# EAGLE design i2s-shifter_rev1 (EAGLE 6.4)
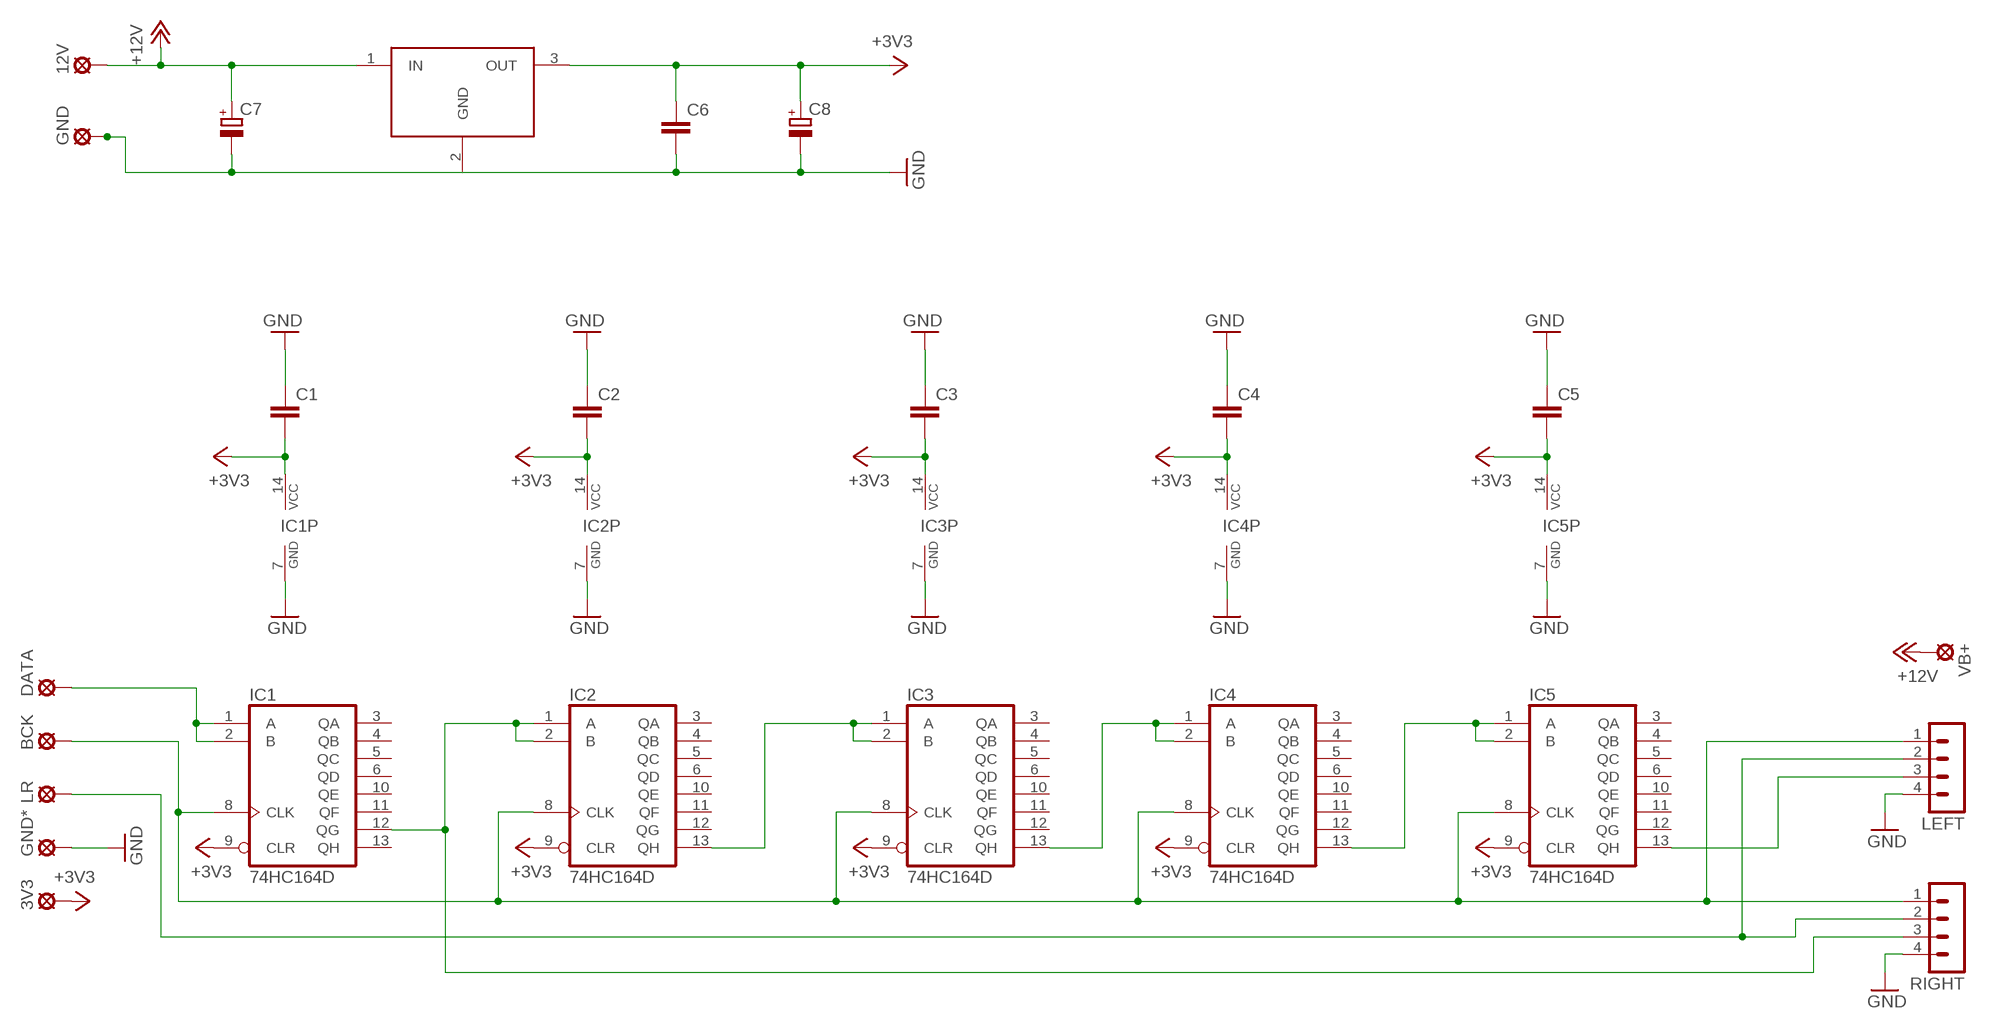
[diagram p0: schematic, sheet 1]

## Parts
3V3  LSP10  [LSP10]
12V  LSP10  [LSP10]
BCK  LSP10  [LSP10]
C1  C-EU050-025X075  [C050-025X075]
C2  C-EU050-025X075  [C050-025X075]
C3  C-EU050-025X075  [C050-025X075]
C4  C-EU050-025X075  [C050-025X075]
C5  C-EU050-025X075  [C050-025X075]
C6  C-EU050-025X075  [C050-025X075]
C7  CPOL-EUE7.5-16  [E7,5-16]
C8  CPOL-EUE5-10.5  [E5-10,5]
DATA  LSP10  [LSP10]
GND  LSP10  [LSP10]
GND*  LSP10  [LSP10]
IC1  74HC164D  [SO14]
IC2  74HC164D  [SO14]
IC3  74HC164D  [SO14]
IC4  74HC164D  [SO14]
IC5  74HC164D  [SO14]
IT1  LM3940IT-3.3  [TO220V]
LEFT  MA04-1  [MA04-1]
LR  LSP10  [LSP10]
RIGHT  MA04-1  [MA04-1]
VB+  LSP10  [LSP10]

## Nets
+3V3: 3V3.MP C1.2 C2.2 C3.2 C4.2 C5.2 C6.1 C8.+ IC1.9(CLR) IC1.14(VCC) IC2.9(CLR) IC2.14(VCC) IC3.9(CLR) IC3.14(VCC) IC4.9(CLR) IC4.14(VCC) IC5.9(CLR) IC5.14(VCC) IT1.3(OUT)
+12V: 12V.MP C7.+ IT1.1(IN) VB+.MP
GND: C1.1 C2.1 C3.1 C4.1 C5.1 C6.2 C7.- C8.- GND*.MP GND.MP IC1.7(GND) IC2.7(GND) IC3.7(GND) IC4.7(GND) IC5.7(GND) LEFT.4 RIGHT.4
N$1: DATA.MP IC1.1(A) IC1.2(B)
N$2: BCK.MP IC1.8(CLK) IC2.8(CLK) IC3.8(CLK) IC4.8(CLK) IC5.8(CLK) LEFT.1 RIGHT.1
N$3: IC1.12(QG) IC2.1(A) IC2.2(B) RIGHT.3
N$4: IC2.13(QH) IC3.1(A) IC3.2(B)
N$5: IC3.13(QH) IC4.1(A) IC4.2(B)
N$6: IC4.13(QH) IC5.1(A) IC5.2(B)
N$7: LEFT.2 LR.MP RIGHT.2
N$8: IC5.13(QH) LEFT.3
Unconnected: IC1.3(QA) IC1.4(QB) IC1.5(QC) IC1.6(QD) IC1.10(QE) IC1.11(QF) IC1.13(QH) IC2.3(QA) IC2.4(QB) IC2.5(QC) IC2.6(QD) IC2.10(QE) IC2.11(QF) IC2.12(QG) IC3.3(QA) IC3.4(QB) IC3.5(QC) IC3.6(QD) IC3.10(QE) IC3.11(QF) IC3.12(QG) IC4.3(QA) IC4.4(QB) IC4.5(QC) IC4.6(QD) IC4.10(QE) IC4.11(QF) IC4.12(QG) IC5.3(QA) IC5.4(QB) IC5.5(QC) IC5.6(QD) IC5.10(QE) IC5.11(QF) IC5.12(QG)

## Power pins joined to a net without a drawn wire
GND: IT1.2(GND)

## Library data of the parts
3V3 12V BCK DATA GND GND* LR VB+ = solpad:LSP10: SOLDER PAD drill 1.0 mm, distributor Buerklin, 12H555
C1-C6 = resistor:C-EU: CAPACITOR, European symbol
C7 C8 = resistor:CPOL-EU: POLARIZED CAPACITOR, European symbol
IC1-IC5 = 74xx-eu:74*164: 8-bit parallel out SHIFT REGISTER
IT1 = LM3940:LM3940IT-3.3: 1A Low Dropout Regulator for 5V to 3.3V Conversion
LEFT RIGHT = con-lstb:MA04-1: PIN HEADER; OC_FARNELL: unknown; OC_NEWARK: unknown

## Board
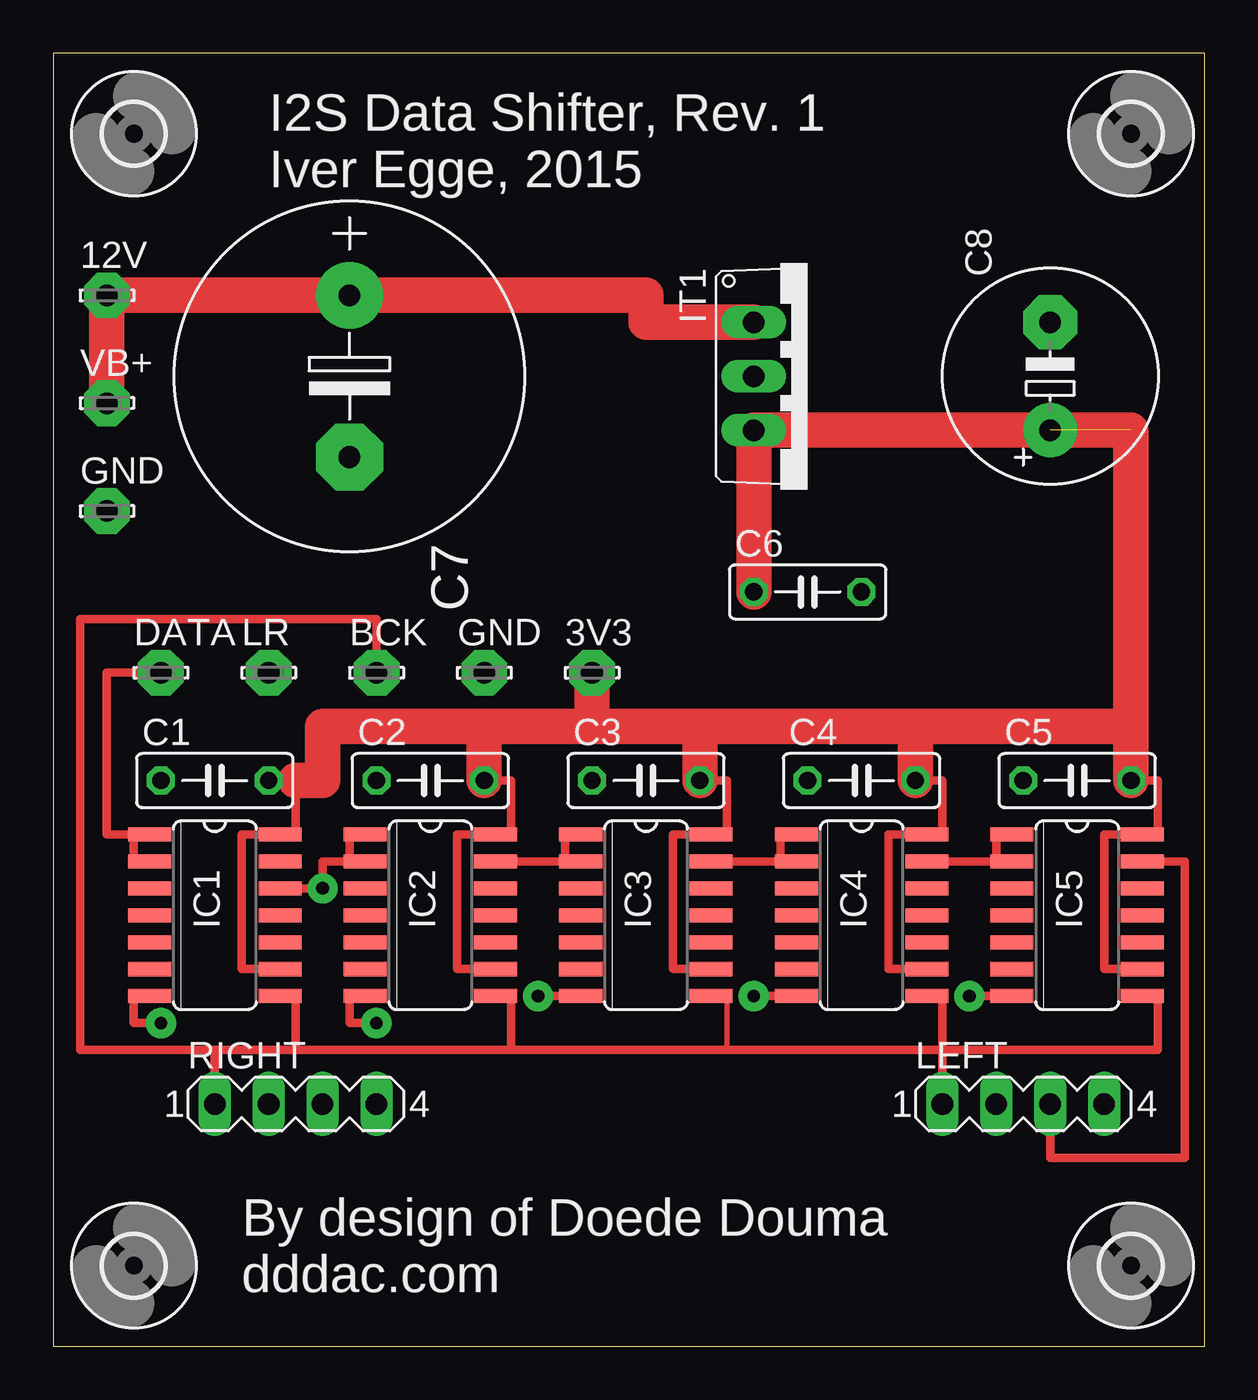
[diagram p1: board, top side]
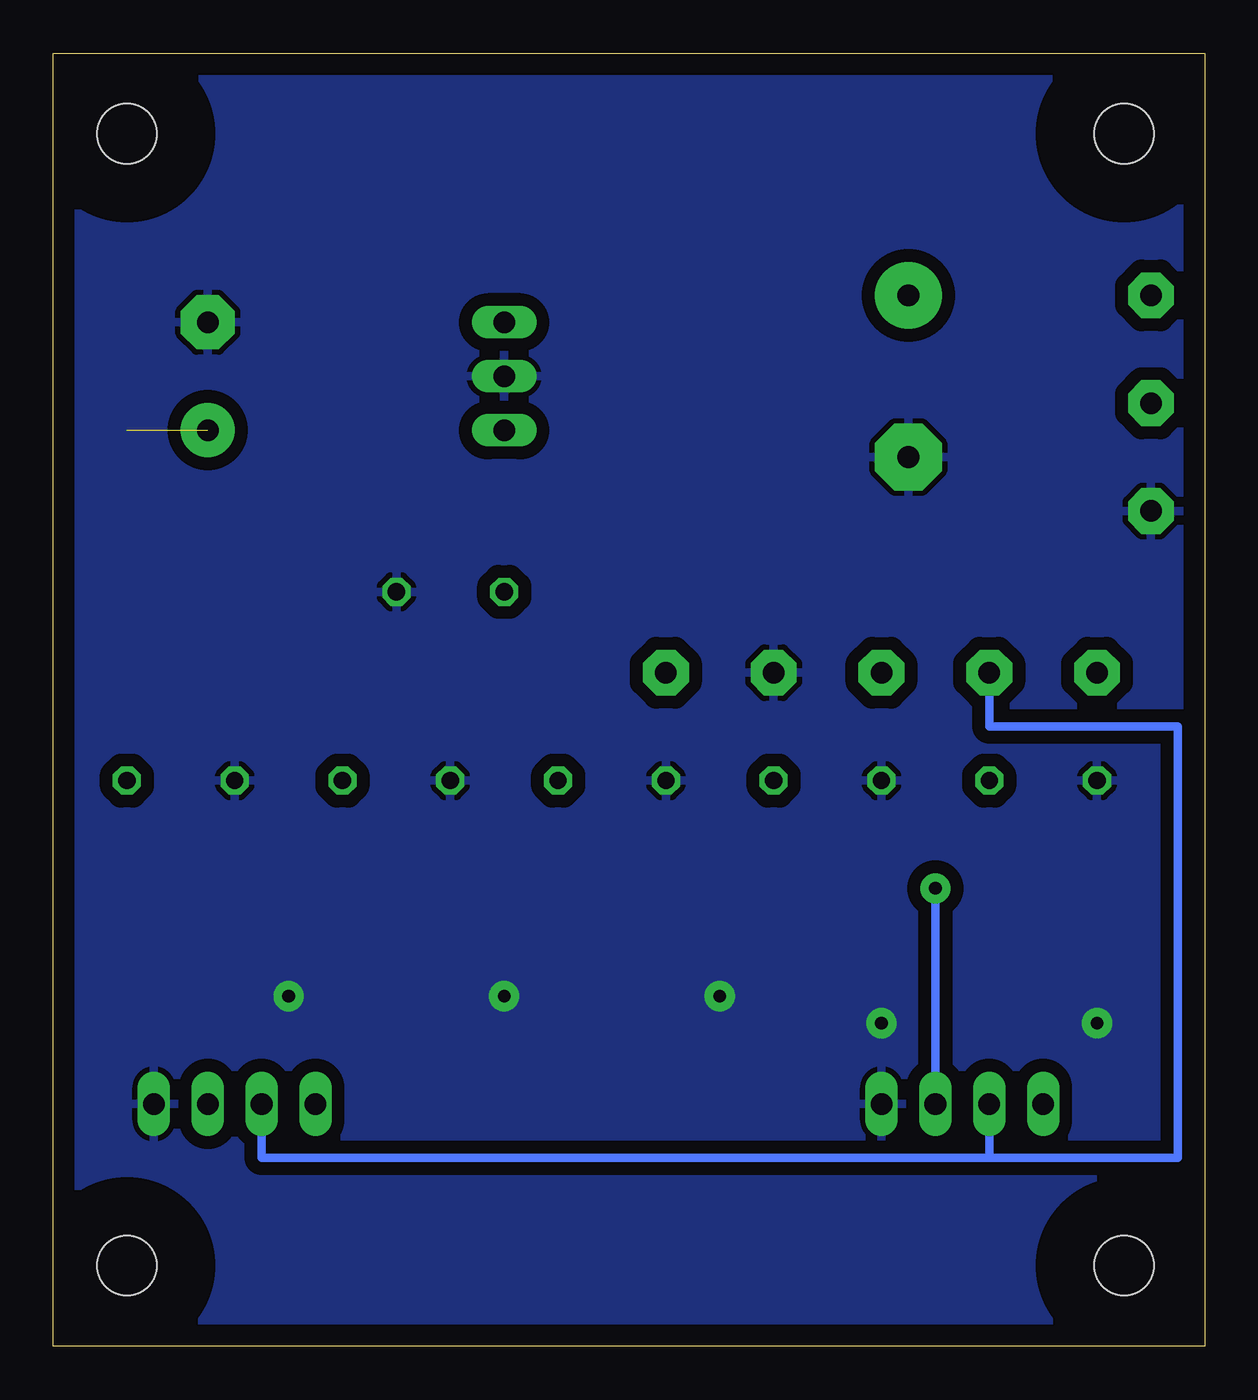
[diagram p2: board, bottom side, seen from below]

Size 54.28 x 60.95 mm. Coordinates in mm from the lower left corner, seen from the top.
Outline: 0,0 54.28,0 54.28,60.95 0,60.95 0,0
Copper layers (1*16): Top 0.035mm / dielectric 1.5mm / Bottom 0.035mm
Design rules "default": minimum track width 10mil, minimum drill 24mil, track to track 8mil, track to pad 8mil, pad to pad 8mil, via to via 8mil, smd to smd 8mil, copper to edge 40mil, drill to drill 8mil, minimum pad ring 10mil, minimum via ring 8mil, stop-mask expansion 4mil, vias tented up to drill 0mil, thermal gap 10mil

### Footprints (pad centres in the part's own frame; a part is rotated, then mirrored left to right if it is on the bottom)
LSP10 = drill 1.016 pad 2.159 octagon: MP 0,0
C050-025X075 = drill 0.813 octagon: 1 -2.54,0; 2 2.54,0
E7,5-16 = drill 1.016 pad 3.15: + -3.81,0 | drill 1.016 pad 3.15 octagon: - 3.81,0
E5-10,5 = drill 1.016 pad 2.54: + -2.54,0 | drill 1.016 pad 2.54 octagon: - 2.54,0
SO14 = smd 0.66 x 2.032: 1 -3.81,-3.073; 2 -2.54,-3.073; 3 -1.27,-3.073; 4 0,-3.073; 5 1.27,-3.073; 6 2.54,-3.073; 7 3.81,-3.073; 8 3.81,3.073; 9 2.54,3.073; 10 1.27,3.073; 11 0,3.073; 12 -1.27,3.073; 13 -2.54,3.073; 14 -3.81,3.073
TO220V = drill 1.016 long: 1 -2.54,-2.54; 2 0,-2.54; 3 2.54,-2.54
MA04-1 = drill 1.016 long: 1 -3.81,0; 2 -1.27,0; 3 1.27,0; 4 3.81,0
2,8 = hole 2.8: 0,0

### Placement (x,y rotation side)
3V3  25.4,31.75 0 top
12V  2.54,49.53 0 top
BCK  15.24,31.75 0 top
C1  7.62,26.67 0 top
C2  17.78,26.67 0 top
C3  27.94,26.67 0 top
C4  38.1,26.67 0 top
C5  48.26,26.67 0 top
C6  35.56,35.56 0 top
C7  13.97,45.72 270 top
C8  46.99,45.72 90 top
DATA  5.08,31.75 0 top
GND  2.54,39.37 0 top
GND*  20.32,31.75 0 top
IC1  7.62,20.32 270 top
IC2  17.78,20.32 270 top
IC3  27.94,20.32 270 top
IC4  38.1,20.32 270 top
IC5  48.26,20.32 270 top
IT1  35.56,45.72 270 top
LEFT  45.72,11.43 0 top
LR  10.16,31.75 0 top
RIGHT  11.43,11.43 0 top
U$1  [2,8]  3.81,57.15 0 top
U$2  [2,8]  50.8,57.15 0 top
U$3  [2,8]  50.8,3.81 0 top
U$4  [2,8]  3.81,3.81 0 top
VB+  2.54,44.45 0 top

### Tracks (layer width: path | path; a pad name or v marks a point on that pad's centre or on a via)
+3V3  (1 unrouted)
  Top 0.406: C1.2 11.43,26.67 11.43,24.13 IC1.14 8.89,24.13 8.89,17.78 IC1.9 | C2.2 21.59,26.67 21.59,24.13 IC2.14 19.05,24.13 19.05,17.78 IC2.9 | C3.2 31.75,26.67 31.75,24.13 IC3.14 29.21,24.13 29.21,17.78 IC3.9 | C4.2 41.91,26.67 41.91,24.13 IC4.14 39.37,24.13 39.37,17.78 IC4.9 | C5.2 52.07,26.67 52.07,24.13 IC5.14 49.53,24.13 49.53,17.78 IC5.9
  Top 1.676: 3V3.MP 25.4,29.21 | 20.32,29.21 12.7,29.21 12.7,26.67 11.43,26.67 | 50.8,29.21 40.64,29.21 | 40.64,29.21 30.48,29.21 | 30.48,29.21 25.4,29.21 | C5.2 50.8,29.21 | C3.2 30.48,29.21 | 25.4,29.21 20.32,29.21 | 20.32,29.21 C2.2 | 40.64,29.21 C4.2 | C6.1 IT1.3 50.8,43.18 50.8,29.21
+12V
  Top 1.676: IT1.1 27.94,48.26 27.94,49.53 C7.+ 12V.MP VB+.MP
GND  (via drill 0.6 pad 1.42)
  Top 0.406: 24.13,16.51 v22.86,16.51 IC3.7 | v33.02,16.51 IC4.7 | v5.08,15.24 3.81,15.24 3.81,16.51 IC1.7 5.08,16.51 | v15.24,15.24 13.97,15.24 13.97,16.51 IC2.7 | IC5.7 v43.18,16.51
  pour Bottom (isolate 0.61): 0,60.96 54.61,60.96 54.61,0 0,0
N$1
  Top 0.406: DATA.MP 2.54,31.75 2.54,24.13 3.81,24.13 | 3.81,24.13 IC1.1 | IC1.2 3.81,22.86 3.81,24.13
N$2
  Top 0.254: 31.75,13.97 31.75,16.51 IC3.8 | 52.07,16.51 IC5.8
  Top 0.406: BCK.MP 15.24,34.29 1.27,34.29 1.27,13.97 7.62,13.97 | 11.43,13.97 21.59,13.97 | 21.59,13.97 31.75,13.97 41.91,13.97 | 41.91,13.97 52.07,13.97 52.07,16.51 | IC4.8 41.91,16.51 41.91,13.97 | 41.91,13.97 LEFT.1 | RIGHT.1 7.62,13.97 | 7.62,13.97 11.43,13.97 | 11.43,13.97 11.43,16.51 IC1.8 | IC2.8 21.59,16.51 21.59,13.97
N$3  (via drill 0.6 pad 1.42)
  Top 0.406: IC2.2 13.97,22.86 | 13.97,22.86 12.7,22.86 v12.7,21.59 IC1.12 | IC2.1 13.97,24.13 13.97,22.86
  Bottom 0.406: v12.7,21.59 RIGHT.3
N$4
  Top 0.406: 24.13,22.86 IC2.13 | IC3.2 24.13,22.86 | 24.13,22.86 24.13,24.13 IC3.1
N$5
  Top 0.406: IC3.13 IC4.2 34.29,22.86 34.29,24.13 IC4.1
N$6
  Top 0.406: IC4.13 44.45,22.86 | 44.45,22.86 IC5.2 | IC5.1 44.45,24.13 44.45,22.86
N$7
  Bottom 0.406: LR.MP 10.16,29.21 1.27,29.21 1.27,8.89 10.16,8.89 | 10.16,8.89 44.45,8.89 LEFT.2 | 10.16,8.89 RIGHT.2
N$8
  Top 0.406: IC5.13 53.34,22.86 53.34,8.89 46.99,8.89 LEFT.3

### Text on the board
tPlace: I2S Data Shifter, Rev. 1 / Iver Egge, 2015 | By design of Doede Douma / dddac.com
tNames: GND